# EAGLE schematic RGB (EAGLE 6.5.0)
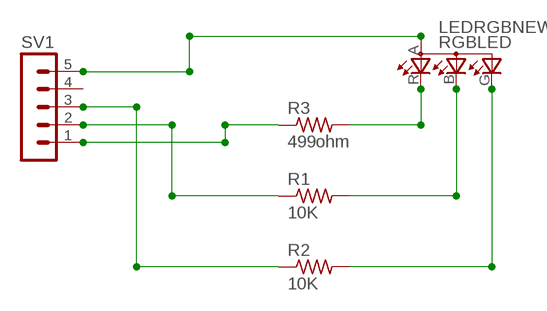
[diagram p0: schematic, sheet 1]

## Parts
R1  10K  RES-US1206FAB  [R1206FAB]
R2  10K  RES-US1206FAB  [R1206FAB]
R3  499ohm  RES-US1206FAB  [R1206FAB]
RGBLED  LEDRGBNEW  [P-LCC-4]
SV1  MA05-1  [MA05-1]

## Nets
N$1: RGBLED.A(A2) SV1.5
N$2: R3.2 RGBLED.R(CRED)
N$3: R3.1 SV1.1
N$4: R1.2 RGBLED.B(CBLUE)
N$5: R1.1 SV1.2
N$6: R2.2 RGBLED.G(CGREEN)
N$7: R2.1 SV1.3
Unconnected: SV1.4

## Library data of the parts
R1-R3 = fab:RES-US: Resistor (US Symbol) Variants with postfix FAB are widened to allow the routing of internal traces
RGBLED = fab:LEDRGBNEW
SV1 = con-lstb:MA05-1: PIN HEADER; OC_FARNELL: unknown; OC_NEWARK: unknown